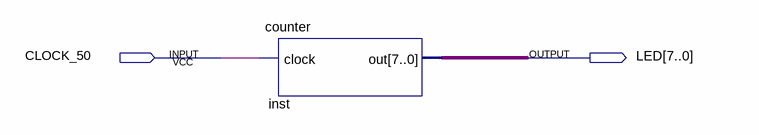
[diagram p0: schematic sheet]
// Quartus schematic LED.bdf as structural Verilog: 1 symbols, 2 pins
module LED (
  input  CLOCK_50,
  output [7:0] LED
);

  counter inst (.clock(CLOCK_50), .out(LED));
endmodule
